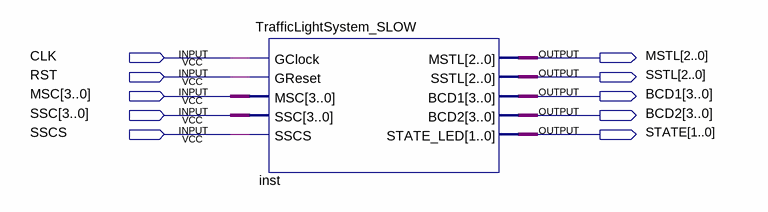
[diagram p0: schematic sheet]
// Quartus schematic top1.bdf as structural Verilog: 1 symbols, 10 pins
module top1 (
  input  CLK,
  input  RST,
  input  [3:0] MSC,
  input  [3:0] SSC,
  input  SSCS,
  output [2:0] MSTL,
  output [2:0] SSTL,
  output [3:0] BCD1,
  output [3:0] BCD2,
  output [1:0] STATE
);

  TrafficLightSystem_SLOW inst (
    .GClock(CLK), .GReset(RST), .MSC(MSC), .SSC(SSC), .SSCS(SSCS), .MSTL(MSTL), .SSTL(SSTL), .BCD1(BCD1),
    .BCD2(BCD2), .STATE_LED(STATE));
endmodule
